# Altium schematic sheet Sheet1.SchDoc
size A4
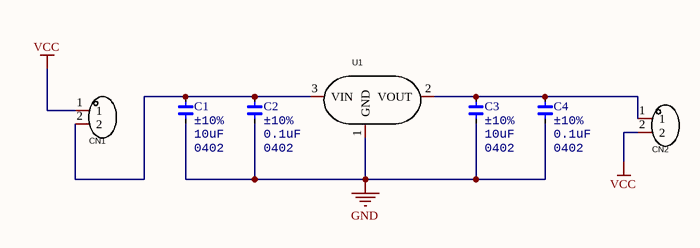
[diagram p0: Sheet1.SchDoc]

## Parts
C1  value 10uF  Note: ±10%  Type: 0402  [CAP_0402]  (hidden comment: C0402)
C2  value 0.1uF  Note: ±10%  Type: 0402  [CAP_0402]  (hidden comment: C0402)
C3  value 10uF  Note: ±10%  Type: 0402  [CAP_0402]  (hidden comment: C0402)
C4  value 0.1uF  Note: ±10%  Type: 0402  [CAP_0402]  (hidden comment: C0402)
CN1  ZX-XH2.54-2PZZ  [CONN-TH_2P-P2.50_HX25003-2A]  (value not drawn)
CN2  ZX-XH2.54-2PZZ  [CONN-TH_2P-P2.50_HX25003-2A]  (value not drawn)
U1  AMS1117-3.3(XBLW)  [SOT-223-3_L6.5-W3.4-P2.30-LS7.0-BR-1]  (value not drawn)

## Nets
GND: C1.1 C2.1 C3.1 C4.1 U1.1(GND)
VCC: CN1.1 CN2.2
NetC1_2: C1.2 C2.2 CN1.2 U1.3(VIN)
NetC3_2: C3.2 C4.2 CN2.1 U1.2(VOUT)

## Library data of the parts
C1-C4 = Cap_0402: Capacitor; Specification: X7R, ±10%, 16V; Manufacturer: *
CN1 CN2 = ZX-XH2.54-2PZZ: Manufacturer: Megastar(兆星); Add into BOM: yes; Pins Structure: 1x2P; Pitch: 2.54mm; Reference Series: XH; Number of PINs Per Row: 2; Current Rating (Max): 3A; Name: ZX-XH2.54-2PZZ; Symbol: ZX-XH2.54-2PZZ; Device: ZX-XH2.54-2PZZ; LCSC Part Name: ZX-XH2.54-2PZZ; Supplier Part: C7429632; Manufacturer Part: ZX-XH2.54-2PZZ; Supplier Footprint: 插件,P=2.54mm; JLCPCB Part Class: Extended Part; Datasheet: https://atta.szlcsc.com/upload/public/pdf/source/20230619/19BA6947230AA44A04D3EDD65E618FD0.pdf; Supplier: LCSC; Convert to PCB: yes; Mounting Style: 直插; Number of Pins: 2P; Number of Rows: 1; Row Spacing: -; Contact Material: 黄铜; Contact Plating: 锡; Operating Temperature Range: -25℃~+85℃
U1 = AMS1117-3.3(XBLW)_C18906017: Manufacturer: XBLW(芯伯乐); Add into BOM: yes; Maximum Input Voltage: 15V; Output Voltage: 3.3V; MAX Output Current: 1A; Power Supply Rejection Ratio (PSRR): 60dB; standby current: 4mA; Number of Outputs: 1; Name: AMS1117-3.3(XBLW); Symbol: AMS1117-3.3(XBLW)_C18906017; Device: AMS1117-3.3(XBLW)_C18906017; LCSC Part Name: AMS1117-3.3(XBLW); Supplier Part: C18906017; Manufacturer Part: AMS1117-3.3(XBLW); Supplier Footprint: SOT-223; JLCPCB Part Class: Extended Part; Datasheet: https://atta.szlcsc.com/upload/public/pdf/source/20231019/F4230EEFC48908FC91962BB59ACA9AD6.pdf; Supplier: LCSC; Convert to PCB: yes; Operating Temperature: -40℃~+125℃